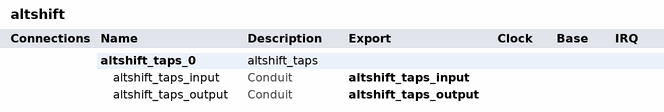
[diagram p0: system contents]
# Platform Designer (Qsys) system altshift, Arria 10 10AX115N2F45I1SG
# Parameters at their usual value, and those the tool derives, are not listed.
package require qsys
create_system altshift
set_project_property DEVICE_FAMILY {Arria 10}
set_project_property DEVICE 10AX115N2F45I1SG

add_instance altshift_taps_0 altshift_taps 20.1
set_instance_property altshift_taps_0 AUTO_EXPORT true
set_instance_parameter_value altshift_taps_0 GUI_GROUP_TAPS false
set_instance_parameter_value altshift_taps_0 GUI_NUMBER_OF_TAPS 2
set_instance_parameter_value altshift_taps_0 GUI_RAM_BLOCK_TYPE M20K
set_instance_parameter_value altshift_taps_0 GUI_TAP_DISTANCE 514
set_instance_parameter_value altshift_taps_0 GUI_TBENCH false
set_instance_parameter_value altshift_taps_0 GUI_USE_ACLR true
set_instance_parameter_value altshift_taps_0 GUI_USE_CLKEN true
set_instance_parameter_value altshift_taps_0 GUI_WIDTH 8

# exported interfaces
add_interface altshift_taps_input conduit end
set_interface_property altshift_taps_input EXPORT_OF altshift_taps_0.altshift_taps_input
add_interface altshift_taps_output conduit end
set_interface_property altshift_taps_output EXPORT_OF altshift_taps_0.altshift_taps_output

set_interconnect_requirement {$system} qsys_mm.clockCrossingAdapter HANDSHAKE
set_interconnect_requirement {$system} qsys_mm.enableEccProtection FALSE
set_interconnect_requirement {$system} qsys_mm.insertDefaultSlave FALSE
set_interconnect_requirement {$system} qsys_mm.maxAdditionalLatency 1

save_system altshift.qsys
